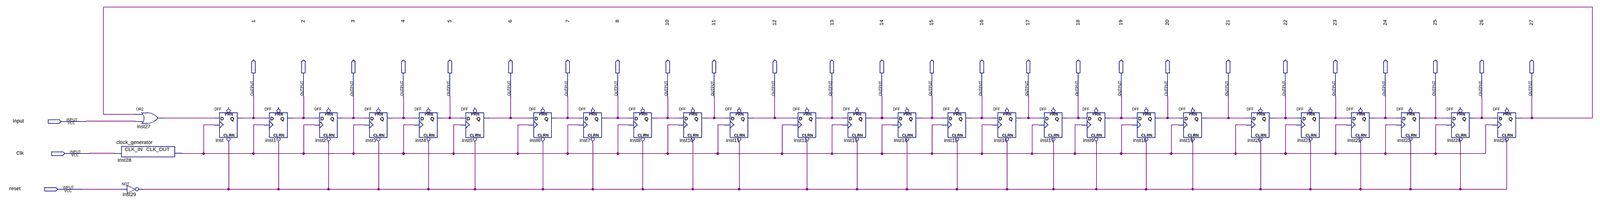
[diagram p0: schematic sheet, whole]
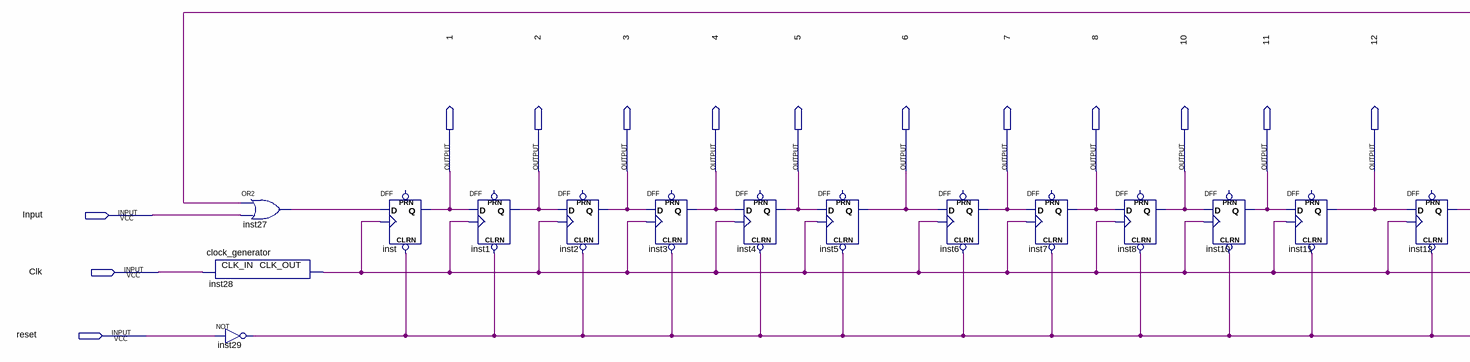
[diagram p1: schematic sheet, left part]
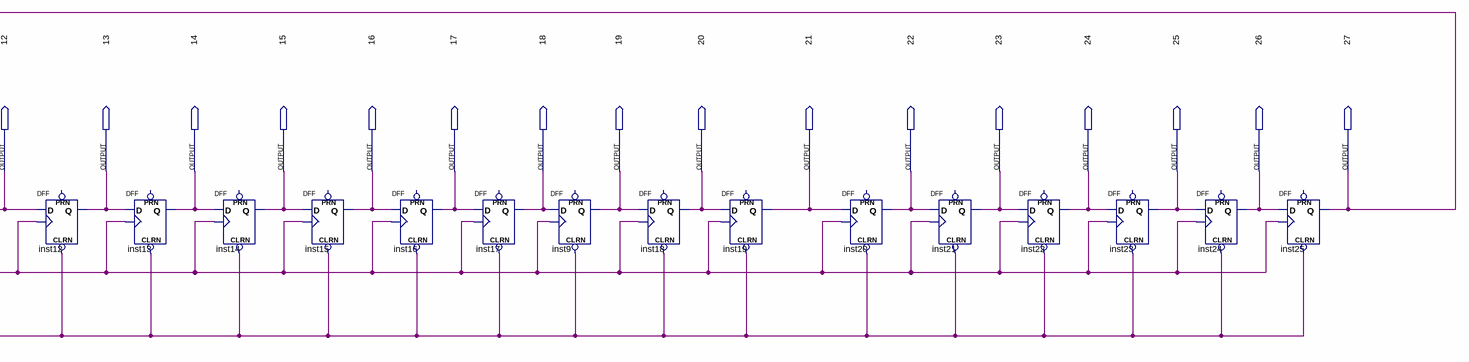
[diagram p2: schematic sheet, right part]
// Quartus schematic test1.bdf as structural Verilog: 29 symbols, 29 pins
module test1 (
  input  Input,
  input  Clk,
  input  reset,
  output \1 ,
  output \2 ,
  output \3 ,
  output \4 ,
  output \5 ,
  output \6 ,
  output \7 ,
  output \8 ,
  output \10 ,
  output \11 ,
  output \12 ,
  output \13 ,
  output \14 ,
  output \15 ,
  output \16 ,
  output \17 ,
  output \18 ,
  output \19 ,
  output \20 ,
  output \21 ,
  output \22 ,
  output \23 ,
  output \24 ,
  output \25 ,
  output \26 ,
  output \27 
);

  wire inst27_out, inst28_clk_out, inst29_out;

  or inst27 (inst27_out, \27 , Input);
  clock_generator inst28 (.CLK_IN(Clk), .CLK_OUT(inst28_clk_out));
  not inst29 (inst29_out, reset);
  DFF inst (.CLRN(inst29_out), .CLK(inst28_clk_out), .D(inst27_out), .Q(\1 ));  // open: PRN
  DFF inst1 (.CLRN(inst29_out), .CLK(inst28_clk_out), .D(\1 ), .Q(\2 ));  // open: PRN
  DFF inst2 (.CLRN(inst29_out), .CLK(inst28_clk_out), .D(\2 ), .Q(\3 ));  // open: PRN
  DFF inst3 (.CLRN(inst29_out), .CLK(inst28_clk_out), .D(\3 ), .Q(\4 ));  // open: PRN
  DFF inst4 (.CLRN(inst29_out), .CLK(inst28_clk_out), .D(\4 ), .Q(\5 ));  // open: PRN
  DFF inst5 (.CLRN(inst29_out), .CLK(inst28_clk_out), .D(\5 ), .Q(\6 ));  // open: PRN
  DFF inst6 (.CLRN(inst29_out), .CLK(inst28_clk_out), .D(\6 ), .Q(\7 ));  // open: PRN
  DFF inst7 (.CLRN(inst29_out), .CLK(inst28_clk_out), .D(\7 ), .Q(\8 ));  // open: PRN
  DFF inst8 (.CLRN(inst29_out), .CLK(inst28_clk_out), .D(\8 ), .Q(\10 ));  // open: PRN
  DFF inst10 (.CLRN(inst29_out), .CLK(inst28_clk_out), .D(\10 ), .Q(\11 ));  // open: PRN
  DFF inst11 (.CLRN(inst29_out), .CLK(inst28_clk_out), .D(\11 ), .Q(\12 ));  // open: PRN
  DFF inst12 (.CLRN(inst29_out), .CLK(inst28_clk_out), .D(\12 ), .Q(\13 ));  // open: PRN
  DFF inst13 (.CLRN(inst29_out), .CLK(inst28_clk_out), .D(\13 ), .Q(\14 ));  // open: PRN
  DFF inst14 (.CLRN(inst29_out), .CLK(inst28_clk_out), .D(\14 ), .Q(\15 ));  // open: PRN
  DFF inst15 (.CLRN(inst29_out), .CLK(inst28_clk_out), .D(\15 ), .Q(\16 ));  // open: PRN
  DFF inst16 (.CLRN(inst29_out), .CLK(inst28_clk_out), .D(\16 ), .Q(\17 ));  // open: PRN
  DFF inst17 (.CLRN(inst29_out), .CLK(inst28_clk_out), .D(\17 ), .Q(\18 ));  // open: PRN
  DFF inst9 (.CLRN(inst29_out), .CLK(inst28_clk_out), .D(\18 ), .Q(\19 ));  // open: PRN
  DFF inst18 (.CLRN(inst29_out), .CLK(inst28_clk_out), .D(\19 ), .Q(\20 ));  // open: PRN
  DFF inst19 (.CLRN(inst29_out), .CLK(inst28_clk_out), .D(\20 ), .Q(\21 ));  // open: PRN
  DFF inst20 (.CLRN(inst29_out), .CLK(inst28_clk_out), .D(\21 ), .Q(\22 ));  // open: PRN
  DFF inst21 (.CLRN(inst29_out), .CLK(inst28_clk_out), .D(\22 ), .Q(\23 ));  // open: PRN
  DFF inst22 (.CLRN(inst29_out), .CLK(inst28_clk_out), .D(\23 ), .Q(\24 ));  // open: PRN
  DFF inst23 (.CLRN(inst29_out), .CLK(inst28_clk_out), .D(\24 ), .Q(\25 ));  // open: PRN
  DFF inst24 (.CLRN(inst29_out), .CLK(inst28_clk_out), .D(\25 ), .Q(\26 ));  // open: PRN
  DFF inst25 (.CLRN(inst29_out), .CLK(inst28_clk_out), .D(\26 ), .Q(\27 ));  // open: PRN
endmodule
